# EAGLE design LED-Board-Dual (EAGLE 8.7.1)
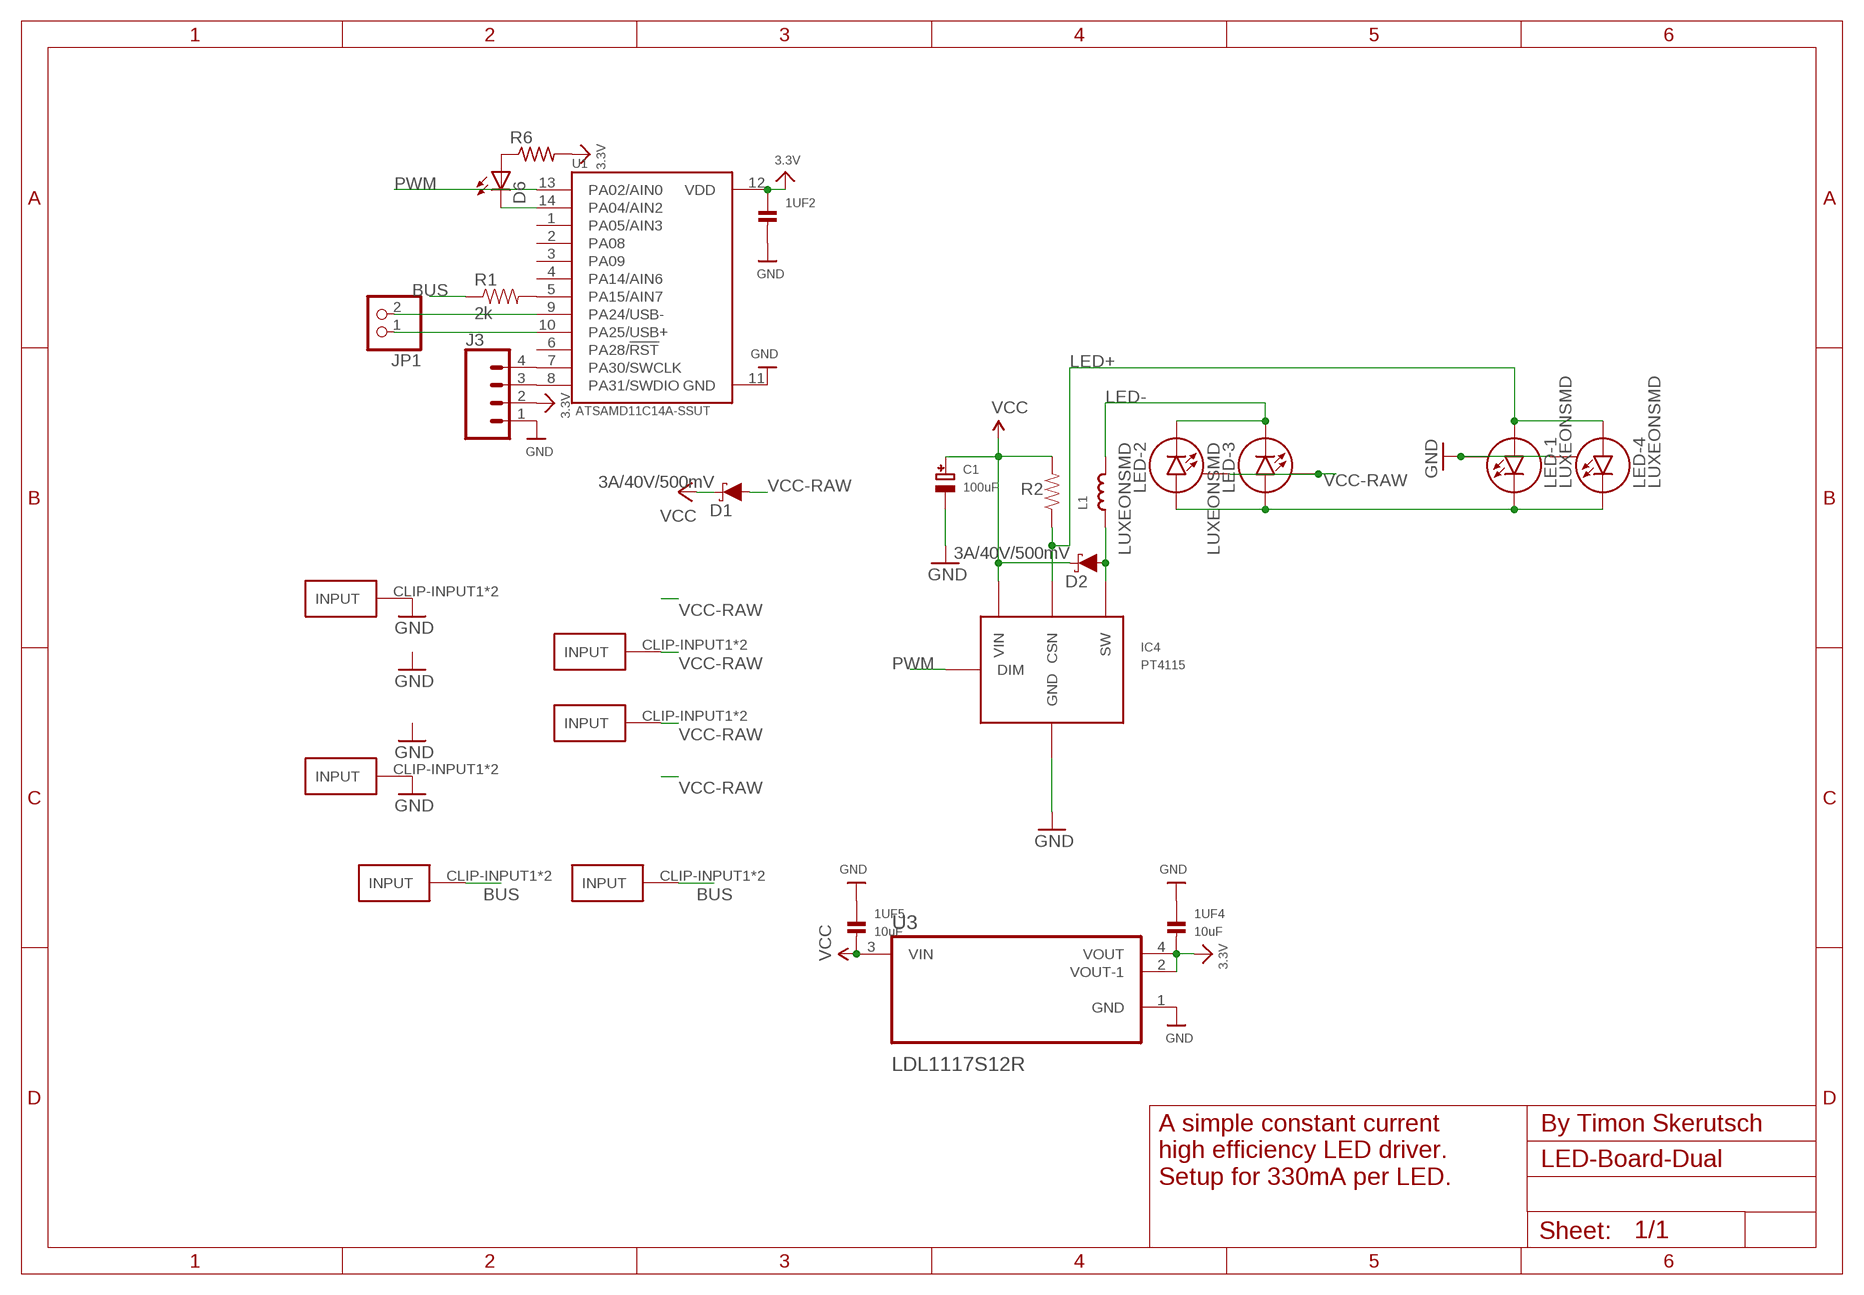
[diagram p0: schematic, sheet 1]

## Parts
1UF2  CAP_CERAMIC0603  [0603]
1UF4  10uF  CAP_CERAMIC0805  [0805]
1UF5  10uF  CAP_CERAMIC0805  [0805]
C1  100uF  CAP_ELECTROLYTICPANASONIC_C  [PANASONIC_C]
D1  3A/40V/500mV  DIODE-SCHOTTKY-B340A  [SMA-DIODE]
D2  3A/40V/500mV  DIODE-SCHOTTKY-B340A  [SMA-DIODE]
D6  LEDCHIPLED_0805  [CHIPLED_0805]
GND-CLIP  FUSE-HOLDER-5X20MM  [FUSE-HOLDER-5X20MM]
GND-CLIP3  FUSE-HOLDER-5X20MM  [FUSE-HOLDER-5X20MM]
IC4  PT4115  [PT4115]
J3  CONN_04  [1X04]
JP1  HEADER-1X2  [1X02_OVAL]
L1  INDUCTORTDK_VLC6045  [INDUCTOR_6X6MM_TDK_VLC6045]
LED-1  LUXEONSMD  [LUXEON]
LED-2  LUXEONSMD  [LUXEON]
LED-3  LUXEONSMD  [LUXEON]
LED-4  LUXEONSMD  [LUXEON]
PWM-CLIP  FUSE-HOLDER-5X20MM  [FUSE-HOLDER-5X20MM]
PWM-CLIP1  FUSE-HOLDER-5X20MM  [FUSE-HOLDER-5X20MM]
R1  2k  RESISTOR1206  [1206]
R2  0.3  RESISTOR1206  [1206]
R6  R-US_R0805  [R0805]
U1  ATSAMD11C14A-SSUT  [SOIC127P600X160-14N]
U3  LDL1117S12R  [SOT230P700X180-4N]
VCC-CLIP  FUSE-HOLDER-5X20MM  [FUSE-HOLDER-5X20MM]
VCC-CLIP3  FUSE-HOLDER-5X20MM  [FUSE-HOLDER-5X20MM]

## Nets
3.3V [VCC]: 1UF2.1 1UF4.2 J3.2 R6.2 U1.12(VDD) U3.2(VOUT-1) U3.4(VOUT)
BUS: PWM-CLIP1.CLIP-INPUT1(INPUT) PWM-CLIP1.CLIP-INPUT2(INPUT) PWM-CLIP.CLIP-INPUT1(INPUT) PWM-CLIP.CLIP-INPUT2(INPUT) R1.1
GND: C1.- GND-CLIP3.CLIP-INPUT1(INPUT) GND-CLIP3.CLIP-INPUT2(INPUT) GND-CLIP.CLIP-INPUT1(INPUT) GND-CLIP.CLIP-INPUT2(INPUT) IC4.2(GND) IC4.2A(GND) J3.1 LED-1.S LED-4.S
LED+: IC4.4(CSN) LED-1.A LED-4.A R2.1
LED-: L1.P$2 LED-2.C LED-3.C
N$1: D2.A IC4.1(SW) L1.P$1
N$2: LED-1.C LED-2.A LED-3.A LED-4.C
N$3: J3.3 U1.8(PA31/SWDIO)
N$4: J3.4 U1.7(PA30/SWCLK)
N$5: R1.2 U1.5(PA15/AIN7)
N$6: D6.A R6.1
N$12: JP1.1 U1.10(PA25/USB+)
N$13: JP1.2 U1.9(PA24/USB-)
N$15: D6.C U1.14(PA04/AIN2)
PWM: IC4.3(DIM) U1.13(PA02/AIN0)
VCC [VCC]: 1UF5.2 C1.+ D1.C D2.C IC4.5(VIN) R2.2 U3.3(VIN)
VCC-RAW [VCC]: D1.A LED-2.S LED-3.S VCC-CLIP3.CLIP-INPUT1(INPUT) VCC-CLIP3.CLIP-INPUT2(INPUT) VCC-CLIP.CLIP-INPUT1(INPUT) VCC-CLIP.CLIP-INPUT2(INPUT)
Unconnected: 1UF2.2 1UF4.1 1UF5.1 U1.1(PA05/AIN3) U1.2(PA08) U1.3(PA09) U1.4(PA14/AIN6) U1.6(PA28/!RST)

## Notes on the sheet
- By Timon Skerutsch
- A simple constant current
  high efficiency LED driver.
  Setup for 330mA per LED.

## Power pins joined to a net without a drawn wire
GND2: U1.11(GND)
GND3: U3.1(GND)

## Library data of the parts
1UF2 1UF4 1UF5 = microbuilder:CAP_CERAMIC: Ceramic Capacitors 0402 - 0402 Surface Mount Capacitors 16pF 50V 5% [Digikey: 445-4899-2-ND] 18pF 50V 5% [Digikey: 490-1281-2-ND] 22pF 50V 5% [Digikey: 490-1283-2-ND] 68pF 50V 5% [Digikey: 490-1289-2-ND] 0.1uF 10V 10% [Digikey: 490-1318-2-ND] 1.0uF 6.3V 10% [Digikey: 490-1320-2-ND] 0603 - 0603 Surface Mount Capacitors 16 pF 50V 5% [Digikey: 445-5051-2-ND] 22 pF 50V [Digikey: PCC220ACVTR-ND] 33 pF 50V 5% [Digikey: 490-1415-1-ND] 56pF 50V 5% [Digikey: 490-1421-1-ND] 220pF 50V 5% [Digikey: 445-1285-1-ND] 680 pF 50V 2200 pF 50V 5% C0G [Digikey: 445-1297-1-ND] 5600 pF 100V 5% X7R [Digikey: 478-3711-1-ND] 0.1 µF 25V 10% [Digikey: PCC2277TR-ND] 0.22 µF 16V 10% X7R [Digikey: 445-1318-1-ND] 1.0 µF 25V 10% [Digikey: 445-5146-2-ND] 0603 - RF Specific 3pF 250V +/-0.1pF RF [Digikey: 712-1347-1-ND] 18 pF 250V 5% [Digikey: 478-3505-1-ND or 712-1322-1-ND] 56 pF 250V 5% C0G RF [Digikey: 490-4867-1-ND] 68 pF 250V RF [Digikey: 490-4868-1-ND] 0805 - 0805 Surface Mount Capacitors 220 pF 250V 2% RF Ceramic Capacitor [Digikey: 712-1398-1-ND] 1000 pF 50V 2% NP0 Ceramic Capacitor [Digikey: 478-3760-1-ND] 0.1 µF 25V 10% Ceramic Capacitor [Digikey: PCC1828TR-ND] 1.0 µF 16V 10% Ceramic Capacitor[Digikey: 490-1691-2-ND] 10.0 µF 10V 10% Ceramic Capacitor[Digikey: 709-1228-1-ND] 10.0 uF 16V 10% Ceramic Capacitor [Digikey: 478-5165-2-ND] 47 uF 6.3V 20% Ceramic Capacitor [Digikey: 587-1779-1-ND or 399-5506-1-ND] 1206 - 1206 Surface Mount Capacitors 47uF 10V 20% Ceramic Capacitor [Digikey: 490-5528-1-ND or 399-5508-1-ND or 445-6010-1-ND] 100uF 6.3V -20%, +80% Y5V Ceramic Capacitor (Digikey: 490-4512-1-ND, Mouser: 81-GRM31CF50J107ZE1L)
C1 = microbuilder:CAP_ELECTROLYTIC: Electrolytic Capacitors SMT PANASONIC_C - Size C Panasonic Electrolytic Aluminum Capacitor 47µF 16V 20% Electrolytic Capacitor [Digikey: PCE3890TR-ND] PANASONIC_D - Size D Panasonic Electrolytic Aluminum Capacitor 100µF 25V 20% Electrolytic Capacitor [Digikey: PCE3898TR-ND] PTH 3.5 mm grid, 8 mm diameter ... 3.5 mm grid, 10 mm diameter ...
D1 D2 = SparkFun-DiscreteSemi:DIODE-SCHOTTKY: Schottky diode A Schottky diode is a semiconductor diode which has a low forward voltage drop and a very fast switching action.; PROD_ID: DIO-09886
D6 = Adafruit:LED: LED OSRAM: - CHIPLED LG R971, LG N971, LY N971, LG Q971, LY Q971, LO R971, LY R971 LH N974, LH R974 LS Q976, LO Q976, LY Q976 LO Q996 - Hyper CHIPLED LW Q18S LB Q993, LB Q99A, LB R99A - SideLED LS A670, LO A670, LY A670, LG A670, LP A670 LB A673, LV A673, LT A673, LW A673 LH A674 LY A675 LS A676, LA A676, LO A676, LY A676, LW A676 LS A679, LY A679, LG A679 - Hyper Micro SIDELED® LS Y876, LA Y876, LO Y876, LY Y876 LT Y87S - SmartLED LW L88C, LW L88S LB L89C, LB L89S, LG L890 LS L89K, LO L89K, LY L89K LS L896, LA L896, LO L896, LY L896 - TOPLED LS T670, LO T670, LY T670, LG T670, LP T670 LSG T670, LSP T670, LSY T670, LOP T670, LYG T670 LG T671, LOG T671, LSG T671 LB T673, LV T673, LT T673, LW T673 LH T674 LS T676, LA T676, LO T676, LY T676, LB T676, LH T676, LSB T676, LW T676 LB T67C, LV T67C, LT T67C, LS T67K, LO T67K, LY T67K, LW E67C LS E67B, LA E67B, LO E67B, LY E67B, LB E67C, LV E67C, LT E67C LW T67C LS T679, LY T679, LG T679 LS T770, LO T770, LY T770, LG T770, LP T770 LB T773, LV T773, LT T773, LW T773 LH T774 LS E675, LA E675, LY E675, LS T675 LS T776, LA T776, LO T776, LY T776, LB T776 LHGB T686 LT T68C, LB T68C - Hyper Mini TOPLED® LB M676 - Mini TOPLED Santana® LG M470 LS M47K, LO M47K, LY M47K Source: http://www.osram.convergy.de/
GND-CLIP GND-CLIP3 PWM-CLIP PWM-CLIP1 VCC-CLIP VCC-CLIP3 = timon-diverses:FUSE-HOLDER-5X20MM
IC4 = PT4115:PT4115: 30V, 1.2A Step-down High Brightness LED Driver with 5000:1 Dimming PDF: http://www.google.pl/url?sa=t&rct=j&q=PT4115&source=web&cd=1&ved=0CC4QFjAA&url=http%3A%2F%2Fwww.micro-bridge.com%2Fdata%2FCRpowtech%2FPT4115E.pdf&ei=9NbxUKXPJNSzhAem2oGoAQ&usg=AFQjCNEsPWIIWjIVjxpF5YN6SPR3coTTpw&bvm=bv.1357700187,d.d2k
J3 = SparkFun-Connectors:CONN_04: Multi connection point. Often used as Generic Header-pin footprint for 0.1 inch spaced/style header connections On any of the 0.1 inch spaced packages, you can populate with these: Break Away Headers - Straight <https://www.sparkfun.com/products/116> (PRT-00116) Break Away Male Headers - Right Angle <https://www.sparkfun.com/products/553> (PRT-00553) Female Headers <https://www.sparkfun.com/products/115> (PRT-00115) Break Away Headers - Machine Pin <https://www.sparkfun.com/products/117> (PRT-00117) Break Away Female Headers - Swiss Machine Pin <https://www.sparkfun.com/products/743> (PRT-00743) For SCREWTERMINALS and SPRING TERMINALS visit here: Screw Terimnals on SparkFun.com <https://www.sparkfun.com/search/results?term=Screw+Terminals> (5mm/3.5mm/2.54mm spacing) This device is also useful as a general connection point to wire up your design to another part of your project. Our various solder wires solder well into these plated through hole pads. Hook-Up Wire - Assortment (Stranded, 22 AWG) <https://www.sparkfun.com/products/11375> (PRT-11375) Hook-Up Wire - Assortment (Solid Core, 22 AWG) <https://www.sparkfun.com/products/11367> (PRT-11367) View the entire wire category on our website here <https://www.sparkfun.com/categories/141> Special notes: Molex polarized connector foot print use with SKU : PRT-08231 with associated crimp pins and housings. 1MM SMD Version SKU: PRT-10208; PROD_ID: CONN-09696
JP1 = microbuilder:HEADER-1X2: PIN HEADER
L1 = microbuilder:INDUCTOR: Inductors 0603: 10nH Ceramic Inductor - microwire antenna/RF (Digikey: 712-1434-2-ND) 0805: 560nH Ceramic Inductor - RF (Digikey: 553-1047-1-ND) 270nH Ceramic Inductor - Q = 40@250MHz, +-5%, 1 Ohm DC Resistance (Digikey: 535-10506-2-ND) 1007 (2518 Metric) SMT: 10µH 10% 250mOhm 820mA 1007 Inductor (Digikey: 587-2189-1-ND) 22µH 10% 500mOhm 580mA 1007 Inductor (Digikey: 587-2190-1-ND) 47µH 10% 950mOhm 420mA 1007 Inductor (Digikey: 587-2191-1-ND) 47µH 5% 100mOhm 1A 1008 Inductor (Digikey: 732-1816-1-ND) 5.0x5.0mm (Taiyo Yuden NR5040 Series) 6.8µH 20% 2.3A 64mOhm Inductor (Digikey: 587-2374-2-ND) 5.0x5.0mm (TDK VLC5045 Series) 4.7µH 20% 3.3A 34mOhm Inductor (Digikey: 445-6526-1-ND) 6.8µH 20% 2.7A 46mOhm Inductor (Digikey: 445-6527-1-ND) 6.0x6.0mm (TDK VLC6045 Series) 4.7µH 20% 3.8A 27mOhm Inductor (Digikey: 445-6538-2-ND) 6.8µH 20% 3A 41mOhm Inductor (Digikey: 445-6540-1-ND) 6.2µH 30% 2.2A 45mOhm Inductor (Digikey: SRR5028-6R2YCT-ND) - Not TDK VLC6045 but footprint should match 6.0x6.0mm (TDK SLF6045 Series) 6.8uH 30% 2A 33mOhm Inductor (Digikey: 445-4572-1-ND, Mouser: 810-SLF645T6R8N2R0PF)
LED-1-LED-4 = SparkFun-LED:LUXEON: Luxeon LED This footprint works with the current 1 Watt, 3 Watt, and 5 Watt LEDs. These blindingly bright LEDs generate a lot of heat so the footprint has a large pad under the LED for thermal transfer. Schematic and footprint are proven. Spark Fun Electronics SKU : COM-00603
R1 R2 = SparkFun-Resistors:RESISTOR: Resistor Basic schematic elements and footprints for 0603, 1206, and PTH resistors.
R6 = Adafruit:R-US_: RESISTOR, American symbol
U1 = ATSAMD11C14A-SSUT:ATSAMD11C14A-SSUT: MCU 32-Bit SAM D11 ARM Cortex M0+ RISC 16KB Flash 1.8V/2.5V/3.3V 14-Pin SOIC T/R; AVAILABILITY: Good; DESCRIPTION: Cortex-M0+, 16KB FLASH, 4KB SRAM, USB - 14 SOIC, INDUSTRIAL, GREEN, 1.6-3.6V, 48MHz/ SOIC .150 (SS); MF: Microchip; MP: ATSAMD11C14A-SSUT; PACKAGE: SOIC-14 Microchip; PRICE: 1.18 USD
U3 = LDL1117S12R:LDL1117S12R: None; AVAILABILITY: Good; DESCRIPTION: 1.2 A High PSRR low dropout linear voltage regulator; MF: STMicroelectronics; MP: LDL1117S12R; PACKAGE: SOT-223 STMicroelectronics; PRICE: 0.22 USD

## Net classes
1 VCC: clearance 0.254 mm

## Board
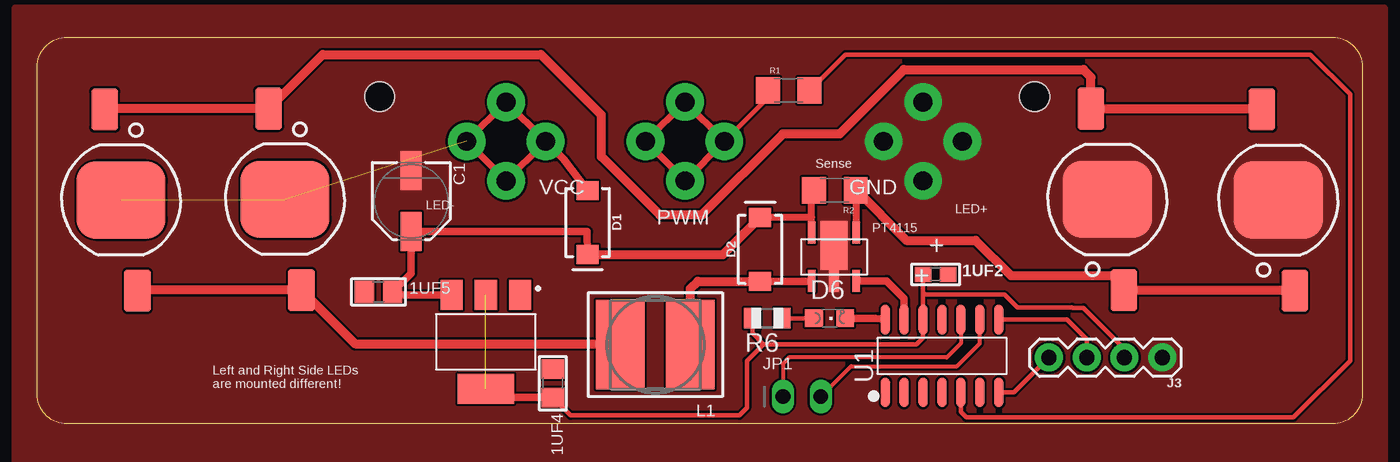
[diagram p1: board, top side]
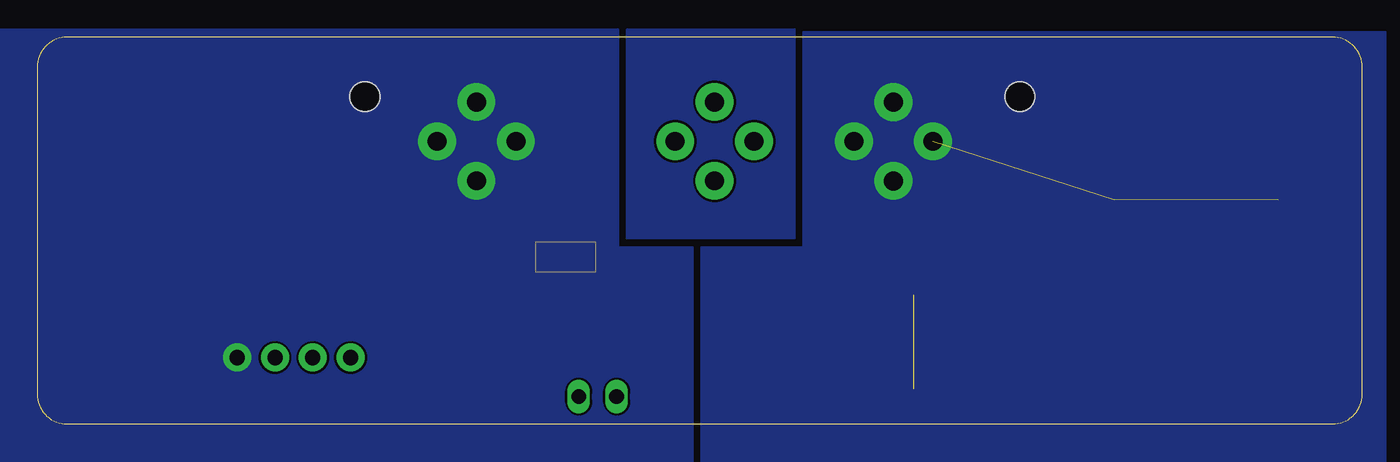
[diagram p2: board, bottom side, seen from below]

Size 89 x 26 mm. Coordinates in mm from the lower left corner, seen from the top.
Outline: 2,26 87,26 arc-90 89,24 89,2 arc-90 87,0 2,0 arc-90 0,2 0,24 arc-90 2,26
Copper layers (1*16): Top 0.035mm / dielectric 1.5mm / Bottom 0.035mm
Design rules "OthermillDRC_30_deg_v2": minimum track width 6mil, minimum drill 0.8mm, track to track 6mil, track to pad 6mil, pad to pad 6mil, via to via 6mil, smd to smd 0mil, copper to edge 0mil, drill to drill 6mil, minimum pad ring 10mil, minimum via ring 10mil, stop-mask expansion 1mil, vias tented up to drill 30mil, thermal gap 6mil
Holes 2 mm at 23,22 67,22

### Footprints (pad centres in the part's own frame; a part is rotated, then mirrored left to right if it is on the bottom)
0603 = smd 1.1 x 1: 1 -0.85,0; 2 0.85,0
0805 = smd 1.3 x 1.5: 1 -0.95,0; 2 0.95,0
PANASONIC_C = smd 2.6 x 1.4: + 2.05,0; - -2.05,0
SMA-DIODE = smd 1.27 x 1.47: A -2.15,0; C 2.15,0
CHIPLED_0805 = smd 1.2 x 1.2: A 0,-1.05; C 0,1.05
FUSE-HOLDER-5X20MM = drill 1.27 pad 2.54: CLIP-INPUT1 -2.65,0; CLIP-INPUT2 2.65,0
PT4115 = smd 0.5 x 1.5: 1 0,0; 3 3,0; 4 3,3.25; 5 0,3.25 | smd 0.65 x 1.5: 2 1.5,0 | smd 1.8 x 3.3: 2A 1.5,2.375
1X04 = drill 1.016 pad 1.88: 1 0,0; 2 2.54,0; 3 5.08,0; 4 7.62,0
1X02_OVAL = drill 1 long: 1 -1.27,0; 2 1.27,0
INDUCTOR_6X6MM_TDK_VLC6045 = smd 3.25 x 6: P$1 -2.35,0; P$2 2.35,0
LUXEON = smd 2.85 x 1.8: A -6.1,-1.1; C 6.1,1.1 | smd 5.2 x 6: S 0,0
1206 = smd 1.6 x 1.8: 1 -1.4,0; 2 1.4,0
R0805 = smd 1.1 x 1.4: 1 -1,0; 2 1,0
SOIC127P600X160-14N = smd 2 x 0.6: 1 -2.45,3.81; 2 -2.45,2.54; 3 -2.45,1.27; 4 -2.45,0; 5 -2.45,-1.27; 6 -2.45,-2.54; 7 -2.45,-3.81; 8 2.45,-3.81; 9 2.45,-2.54; 10 2.45,-1.27; 11 2.45,0; 12 2.45,1.27; 13 2.45,2.54; 14 2.45,3.81
SOT230P700X180-4N = smd 1.5 x 2: 1 -2.3,-3.15; 2 0,-3.15; 3 2.3,-3.15 | smd 3.8 x 2: 4 0,3.15

### Placement (x,y rotation side)
1UF2  60.34,10.05 0 top
1UF4  34.63,2.73 270 top
1UF5  22.92,8.88 0 top
C1  25.12,14.99 270 top
D1  36.97,13.54 270 top
D2  48.55,11.74 90 top
D6  53.22,7.11 270 top
GND-CLIP  59.5,19 0 bottom
GND-CLIP3  59.5,19 90 bottom
IC4  52.02,9.62 0 top
J3  75.57,4.47 180 top
JP1  51.35,1.85 0 top
L1  41.52,5.33 180 top
LED-1  71.88,15.1 90 top
LED-2  5.63,15.05 270 top
LED-3  16.64,15.1 270 top
LED-4  83.36,15.05 90 top
PWM-CLIP  43.5,19 0 bottom
PWM-CLIP1  43.5,19 90 bottom
R1  50.47,22.42 0 top
R2  53.57,15.71 180 top
R6  49.03,7.11 180 top
U1  60.77,4.58 90 top
U3  30.13,5.52 180 top
VCC-CLIP  31.5,19 0 bottom
VCC-CLIP3  31.5,18.99 270 bottom

### Tracks (layer width: path | path; a pad name or v marks a point on that pad's centre or on a via)
3.3V  (1 unrouted)
  Top 0.305: 59.49,8.83 U1.12 59.5,5.8 59.07,5.37 48.78,5.37 | 59.49,8.83 1UF2.1 | 59.49,8.83 59.62,8.7 64.96,8.7 65.82,7.84 69.5,7.84 69.52,7.81 70.28,7.81 73.03,5.06 J3.2 | 1UF4.2 35.83,0.58 47.16,0.58 47.67,1.08 47.67,4.26 48.78,5.37 | 48.78,5.37 48.03,6.11 R6.2
  Top 0.508: U3.4 30.72,1.78 1UF4.2
BUS
  Top 0.305: PWM-CLIP.CLIP-INPUT1 46.21,19.06 49.07,21.92 R1.1
  Top 0.483: PWM-CLIP1.CLIP-INPUT2 PWM-CLIP.CLIP-INPUT2 | PWM-CLIP.CLIP-INPUT2 PWM-CLIP1.CLIP-INPUT1 46.21,19.05 46.21,19.06 | PWM-CLIP1.CLIP-INPUT2 | PWM-CLIP.CLIP-INPUT1 PWM-CLIP1.CLIP-INPUT2
GND
  pour Top (rank 2, no thermals): -1.5,28 90.5,28 90.5,-31 -1.5,-31
  pour Bottom (rank 2, no thermals): 45,11.87 50,11.87 50,26.5 93.5,26.5 93.5,-32 45,-32
LED+
  Top 0.483: IC4.4 55.02,15.71 R2.1
  Top 0.61: 55.02,15.71 58.38,12.35 63.02,12.35 65.4,9.97 72.94,9.97 72.98,9.94 LED-1.A 84.41,9 LED-4.A
LED-
  Top 0.61: L1.P$2 39.1,5.4 21.34,5.4 LED-3.C 6.78,9 LED-2.C
N$1
  Top 0.508: D2.A 52.02,9.59 IC4.1
  Top 0.61: L1.P$1 43.87,9.1 44.37,9.59 44.38,9.59 D2.A
N$2
  Top 0.61: LED-2.A 4.58,21.2 LED-3.A 19.18,24.83 33.83,24.83 37.89,20.77 37.89,17.98 41.83,14.04 44.62,14.04 50.09,19.5 53.9,19.5 58.21,23.82 70.28,23.82 70.79,23.31 70.78,23.3 LED-1.C 82.21,21.2 LED-4.C
N$3
  Top 0.305: U1.8 69.16,7.03 70.49,5.7 J3.3
N$4
  Top 0.305: U1.7 65.61,2.13 J3.4
N$5
  Top 0.305: U1.5 62.04,0.81 62.4,0.45 76,0.45 76.12,0.45 84.38,0.45 88.19,4.26 88.19,22.17 85.52,24.83 74.34,24.83 74.22,24.83 54.29,24.83 R1.2
N$6
  Top 0.305: D6.A R6.1
N$12
  Top 0.254: U1.10 62.04,5.42 61.1,4.48 50.51,4.48 50.09,4.06 JP1.1
N$13
  Top 0.254: JP1.2 54.66,3.88 61.77,3.88 63.31,5.42 U1.9
N$15
  Top 0.508: U1.14 56.28,7.11 D6.C
PWM
  Top 0.508: IC4.3 57.04,9.62 58.21,8.45 58.21,7.04 U1.13
  pour Bottom (rank 3): 38.13,26.5 38.13,12.5 49.37,12.5 49.37,26.5
VCC
  Top 0.483: R2.2 52.02,15.71 IC4.5 52.02,13.89 D2.C
  Top 0.508: D1.C 36.94,12.94 C1.+ 25.12,10.13 1UF5.2 24.08,8.67 U3.3
  Top 0.61: D1.C 46.06,11.39 D2.C
VCC-RAW  (2 unrouted)
  Top 0.483: VCC-CLIP3.CLIP-INPUT2 | VCC-CLIP3.CLIP-INPUT2 34.04,18.89 | 34.04,18.89 VCC-CLIP.CLIP-INPUT1 | 34.04,18.89 34.04,19.11 VCC-CLIP3.CLIP-INPUT1 VCC-CLIP.CLIP-INPUT2 31.5,16.35 VCC-CLIP3.CLIP-INPUT2
  Top 0.508: VCC-CLIP.CLIP-INPUT1 35.35,17.8 D1.A
  pour Bottom (no thermals): -1.53,26.34 -1.53,-31.81 44.38,-31.81 44.38,11.88 37.52,11.88 37.52,26.34

### Text on the board
tPlace: Sense | + | + | Left and Right Side LEDs / are mounted different!
tNames: VCC | GND | LED- | LED+ | PWM | PT4115